# Altium project 2.4GHZ SX1280 4W.PrjPcb
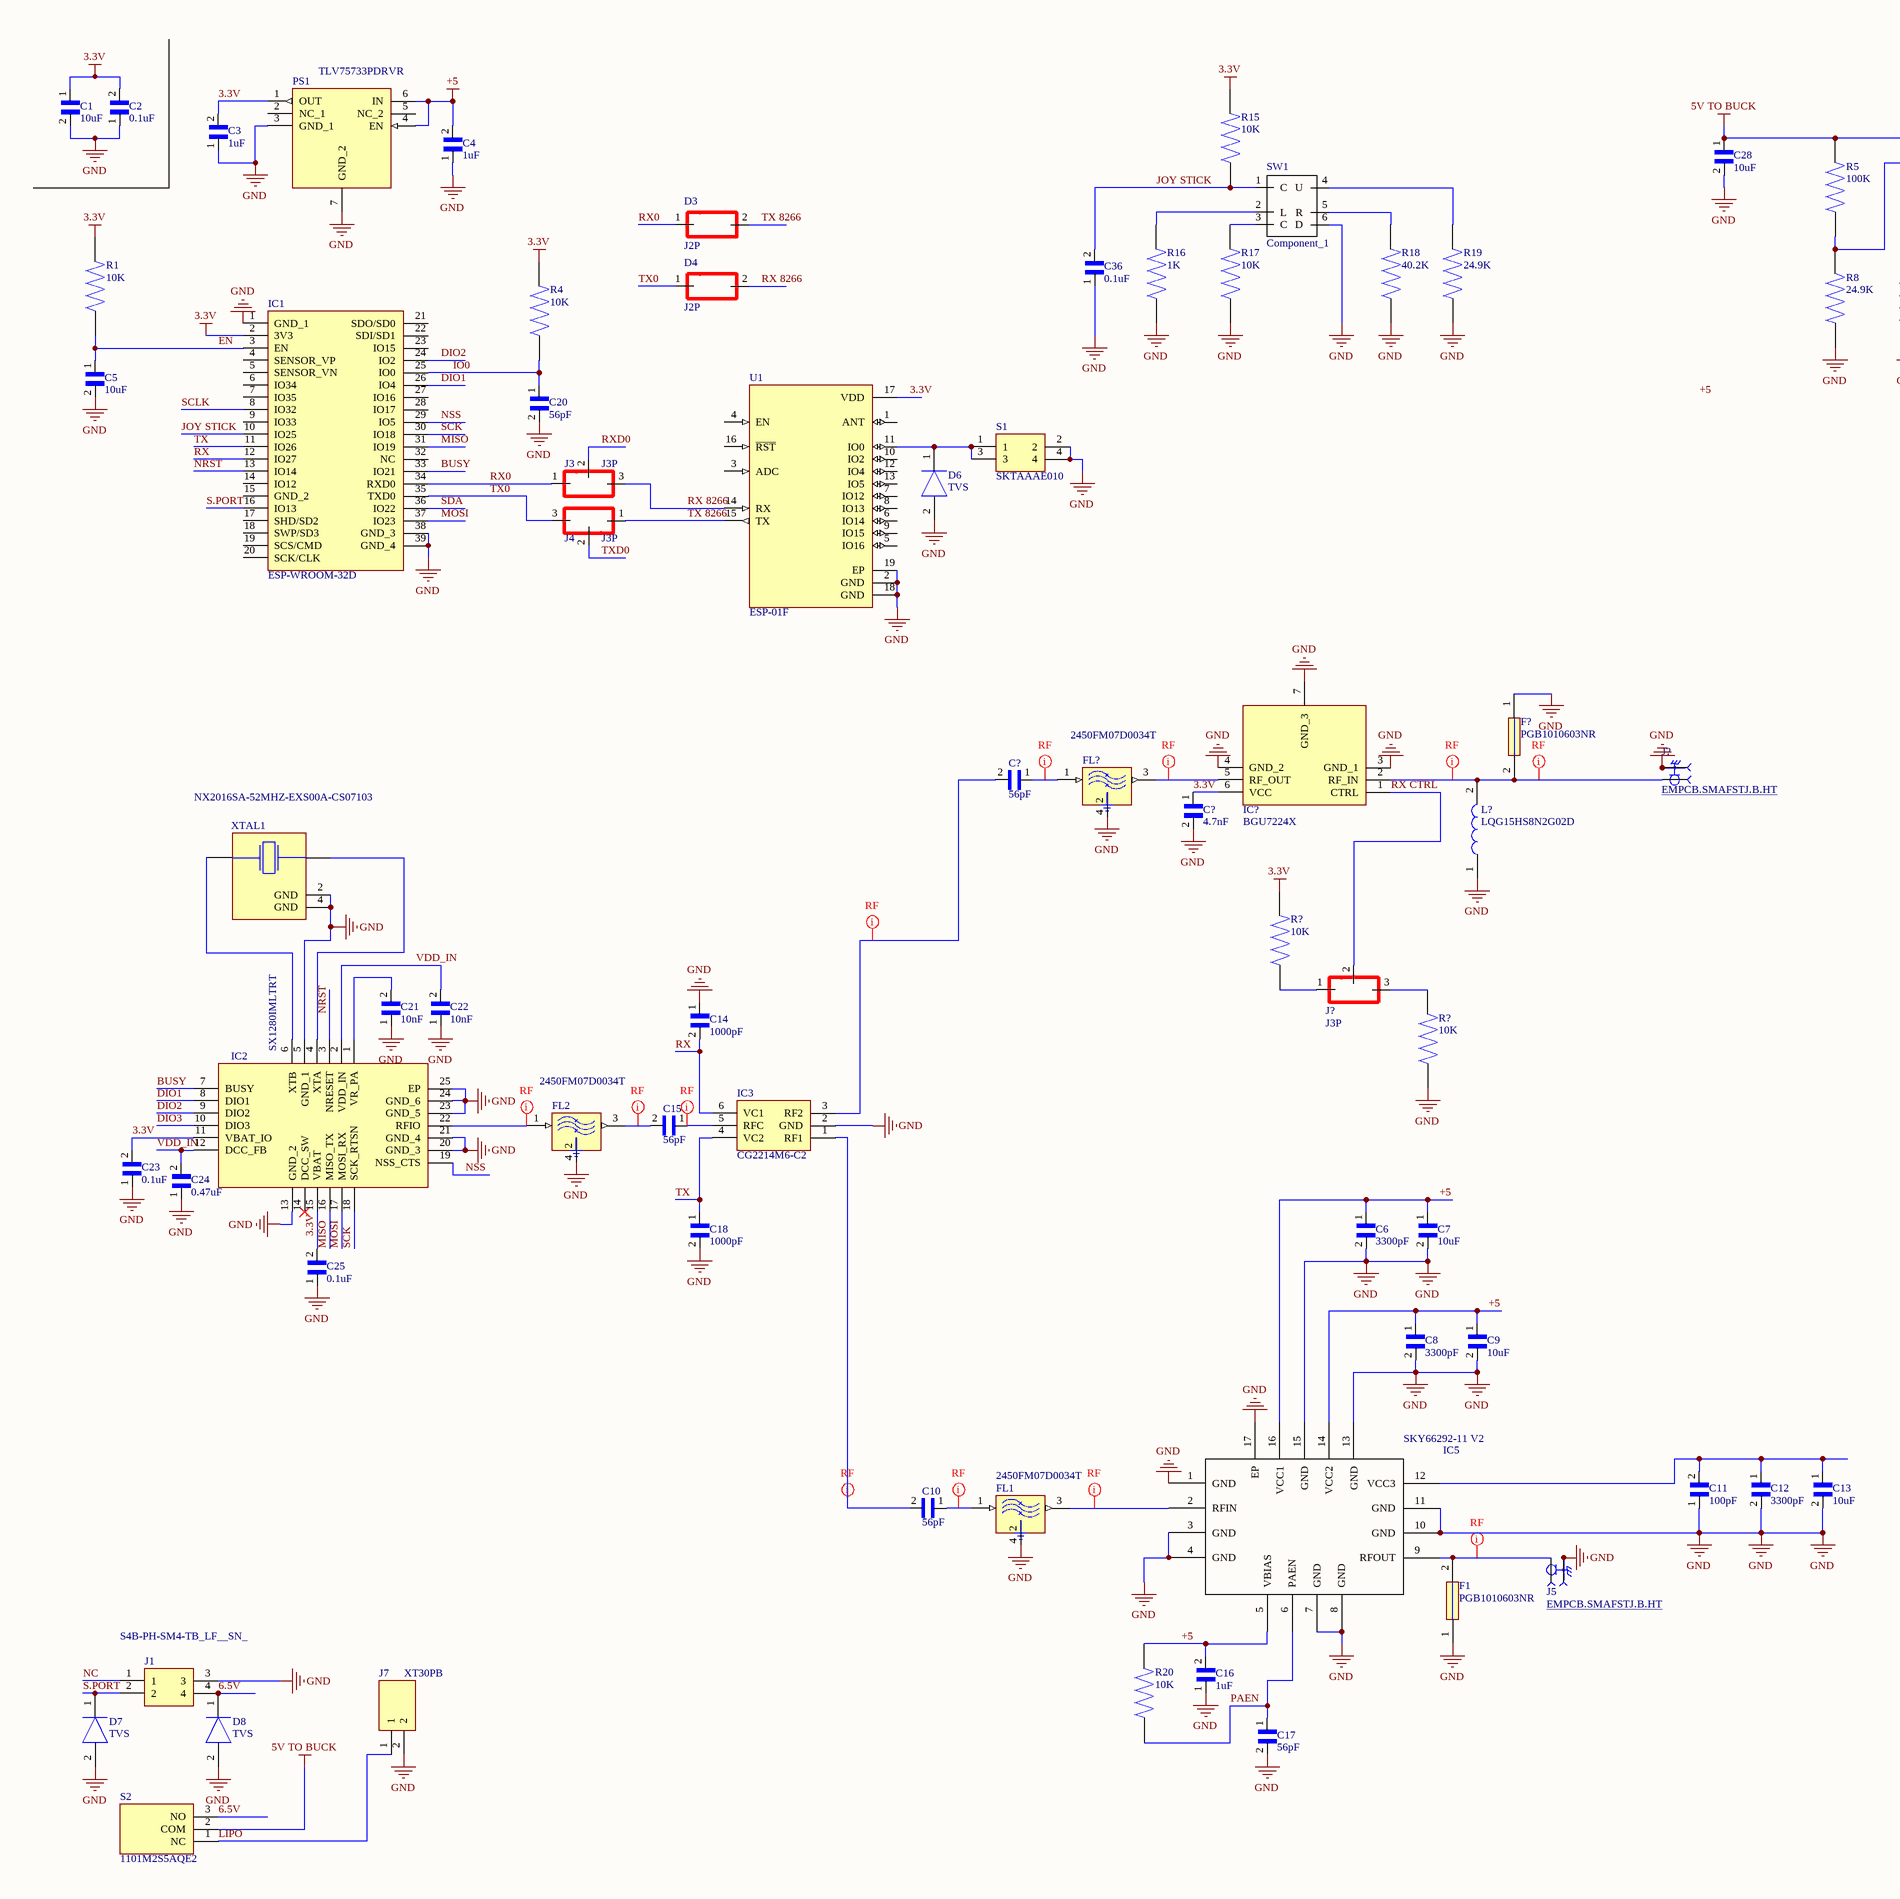
[diagram p0: OD JRBAY.SchDoc, left]
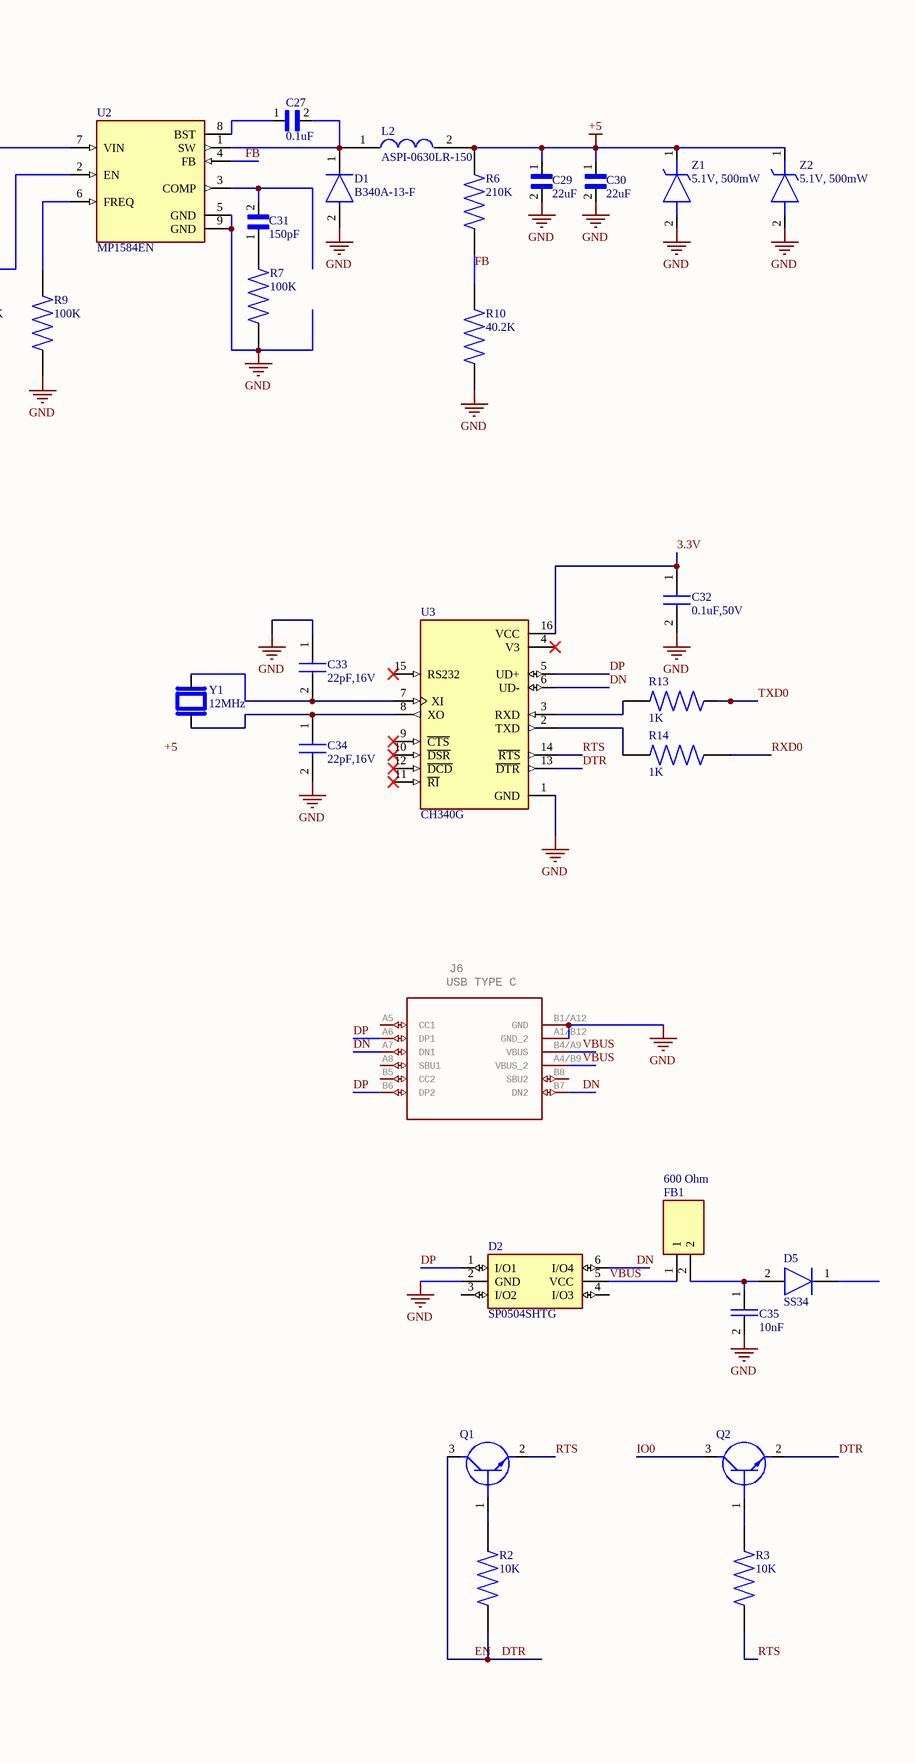
[diagram p1: OD JRBAY.SchDoc, right]
2 sheets, 196 parts. Net scope: global (net labels, ports and power ports of the same name join across sheets).
Board file: OD JRBAY.PcbDoc
Sheets:
  OD JRBAY.SchDoc
  Reference sche.SchDoc

## Sheet OD JRBAY.SchDoc
size A2

### Parts
(Parts that share a designator on the sheet are numbered #1, #2 ... from top to bottom, then left to right.)
C1  10uF  [CAPC2012X140N]
C2  0.1uF  [CAPC1005X56N]
C3  1uF  [CAPC1608X100N]
C4  1uF  [CAPC1608X100N]
C5  10uF  [CAPC2012X140N]
C6  3300pF  [CAPC1005X56N]
C7  10uF  [CAPC2012X140N]
C8  3300pF  [CAPC1005X56N]
C9  10uF  [CAPC2012X140N]
C10  56pF  [CAPC1005X56N]
C11  100pF  [CAPC1608X100N]
C12  3300pF  [CAPC1005X56N]
C13  10uF  [CAPC2012X140N]
C14  1000pF  [CAPC1005X56N]
C15  56pF  [CAPC1005X56N]
C16  1uF  [CAPC1608X100N]
C17  56pF  [CAPC1005X56N]
C18  1000pF  [CAPC1005X56N]
C20  56pF  [CAPC1005X56N]
C21  10nF  [CAPC1608X100N]
C22  10nF  [CAPC1608X100N]
C23  0.1uF  [CAPC1005X56N]
C24  0.47uF  [CAPC1005X56N]
C25  0.1uF  [CAPC1005X56N]
C27  0.1uF  [CAPC1005X56N]
C28  10uF  [CAPC2012X140N]
C29  22uF  [CAPC2012X140N]
C30  22uF  [CAPC2012X140N]
C31  150pF  [CAPC1005X56N]
C32  0.1uF,50V  [CAPC1608X08M]
C33  22pF,16V  [CAPC1608X08M]
C34  22pF,16V  [CAPC1608X08M]
C35  10nF  [CAPC1608X08M]
C36  0.1uF  [CAPC1005X56N]
C?#1  56pF  [CAPC1005X56N]
C?#2  4.7nF  [CAPC1005X56N]
D1  B340A-13-F  [DIOM5226X240N]
D2  SP0504SHTG  [SOT95P280X145-6N]
D3  J2P  [J2P]
D4  J2P  [J2P]
D5  SS34  [DIOM5226X240N]
D6  TVS  [SODFL1608X70N]
D7  TVS  [SODFL1608X70N]
D8  TVS  [SODFL1608X70N]
F1  PGB1010603NR  [FUSC1708X36N]
F?#1  PGB1010603NR  [FUSC1708X36N]
FB1  600 Ohm  [BEADC2012X105N]
FL1  2450FM07D0034T  [FIL_2450FM07D0034T]
FL2  2450FM07D0034T  [FIL_2450FM07D0034T]
FL?#1  2450FM07D0034T  [FIL_2450FM07D0034T]
IC1  ESP-WROOM-32D  [ESPWROOM32D]
IC2  SX1280IMLTRT  [QFN50P400X400X100-25N-D]
IC3  CG2214M6-C2  [SOTFL48P130X55-6N]
IC5  SKY66292-11 V2  [SKY66292-11]
IC?#1  BGU7224X  [SON50P160X160X50-7N]
J1  S4B-PH-SM4-TB_LF__SN_  [S4B-PH-SM4-TB]
J3  J3P  [J3P]
J4  J3P  [J3P]
J5  EMPCB.SMAFSTJ.B.HT  [TAOGLAS_EMPCB.SMAFSTJ.B.HT]
J6  USB TYPE C  [2171790001_MOL]
J7  XT30PB  [XT30PB]
J?#1  EMPCB.SMAFSTJ.B.HT  [TAOGLAS_EMPCB.SMAFSTJ.B.HT]
J?#2  J3P  [J3P]
L2  ASPI-0630LR-150  [ASPI-0630LR-150]
L?#1  LQG15HS8N2G02D  [LQG15WH0N7B02D]
PS1  TLV75733PDRVR  [SON65P200X200X80-7N]
Q1  BC847AMTF  [SOT95P240X120-3N]  (value not drawn)
Q2  BC847AMTF  [SOT95P240X120-3N]  (value not drawn)
R1  10K  [RESC1005X37N]
R2  10K  [RESC1005X37N]
R3  10K  [RESC1005X37N]
R4  10K  [RESC1005X37N]
R5  100K  [RESC1005X37N]
R6  210K  [RESC1005X37N]
R7  100K  [RESC1005X37N]
R8  24.9K  [RESC1005X37N]
R9  100K  [RESC1005X37N]
R10  40.2K  [RESC1005X37N]
R13  1K  [RESC1005X37N]
R14  1K  [RESC1005X37N]
R15  10K  [RESC1005X37N]
R16  1K  [RESC1005X37N]
R17  10K  [RESC1005X37N]
R18  40.2K  [RESC1005X37N]
R19  24.9K  [RESC1005X37N]
R20  10K  [RESC1005X37N]
R?#1  10K  [RESC1005X37N]
R?#2  10K  [RESC1005X37N]
S1  SKTAAAE010  [SKTAAAE010]
S2  1101M2S5AQE2  [1101M2S5AQE2]
SW1  Component_1  [5 WAY SWITCH]
U1  ESP-01F  [MODULE_ESP-01F]
U2  MP1584EN  [SOIC127P600X170-9N]
U3  CH340G  [SOIC127P600X175-16N]
XTAL1  NX2016SA-52MHZ-EXS00A-CS07103  [OSCCC200X160X50N]
Y1  12MHz  [XTAL_SXT2248EE17-12.000MT]
Z1  5.1V, 500mW  [SOD3716X135N]
Z2  5.1V, 500mW  [SOD3716X135N]

### Nets
3.3V: C1.1 C2.2 C3.2 C23.2 C25.2 C32.1 C?#2.1 IC1.2(3V3) IC2.11(VBAT_IO) IC2.15(VBAT) IC?#1.6(VCC) PS1.1(OUT) R1.2 R4.2 R15.2 R?#1.2 U1.17(VDD) U3.16(VCC)
5V TO BUCK: C28.1 R5.2 S2.2(COM) U2.7(VIN)
+5: C4.2 C6.1 C7.1 C8.1 C9.1 C16.2 C29.1 C30.1 IC5.5(VBIAS) IC5.14(VCC2) IC5.16(VCC1) L2.2 PS1.4(EN) PS1.6(IN) R6.2 R20.2 Z1.1(K) Z2.1(K)
GND: C1.2 C2.1 C3.1 C4.1 C5.2 C6.2 C7.2 C8.2 C9.2 C11.1 C12.2 C13.2 C14.1 C16.1 C17.2 C18.2 C20.2 C21.1 C22.1 C23.1 C24.1 C25.1 C28.2 C29.2 C30.2 C32.2 C33.1 C34.2 C35.2 C36.1 C?#2.2 D1.2(A) D2.2(GND) D6.2(A) D7.2(A) D8.2(A) F1.1 F?#1.1 FL1.4(GND) FL2.4(GND) FL?#1.4(GND) IC1.1(GND_1) IC1.38(GND_3) IC1.39(GND_4) IC2.5(GND_1) IC2.13(GND_2) IC2.20(GND_3) IC2.21(GND_4) IC2.23(GND_5) IC2.24(GND_6) IC2.25(EP) IC3.2(GND) IC5.1(GND) IC5.3(GND) IC5.4(GND) IC5.7(GND) IC5.8(GND) IC5.10(GND) IC5.11(GND) IC5.13(GND) IC5.15(GND) IC5.17(EP) IC?#1.3(GND_1) IC?#1.4(GND_2) IC?#1.7(GND_3) J1.3 J5.SH1 J5.SH2 J5.SH3 J5.SH4 J6.A1/B12(GND_2) J6.B1/A12(GND) J7.2 J?#1.SH1 J?#1.SH2 J?#1.SH3 J?#1.SH4 L?#1.1 PS1.3(GND_1) PS1.7(GND_2) R7.1 R8.1 R9.1 R10.1 R16.1 R17.1 R18.1 R19.1 R?#2.1 S1.2 S1.4 SW1.6(D) U1.2(GND) U1.18(GND) U1.19(EP) U2.5(GND) U2.9(GND) U3.1(GND) XTAL1.2(GND) XTAL1.4(GND) Z1.2(A) Z2.2(A)
6.5V: D8.1(K) J1.4 S2.3(NO)
BUSY: IC1.33(IO21) IC2.7(BUSY)
DIO1: IC1.26(IO4) IC2.8(DIO1)
DIO2: IC1.24(IO2) IC2.9(DIO2)
DIO3: IC2.10(DIO3)
DN: D2.6(I/O4) J6.A7(DN1) J6.B7(DN2) U3.6(UD-)
DP: D2.1(I/O1) J6.A6(DP1) J6.B6(DP2) U3.5(UD+)
DTR: C5.1 IC1.3(EN) Q1.3(C) Q2.2(E) R1.1 R2.1 U3.13(~{DTR})  [also labelled EN]
FB: R6.1 R10.2 U2.4(FB)
IO0: C20.1 IC1.25(IO0) Q2.3(C) R4.1
JOY STICK: C36.2 IC1.10(IO25) R15.1 SW1.1(C)
LIPO: J7.1 S2.1(NC)
MISO: IC1.31(IO19) IC2.16(MISO_TX)
MOSI: IC1.37(IO23) IC2.17(MOSI_RX)
NC: J1.1
NRST: IC1.13(IO14) IC2.3(NRESET)
NSS: IC1.29(IO5) IC2.19(NSS_CTS)
PAEN: C17.1 IC5.6(PAEN) R20.1
RTS: Q1.2(E) R3.1 U3.14(~{RTS})
RX: C14.2 IC1.12(IO27) IC3.6(VC1)
RX0: D3.1 IC1.34(RXD0) J3.1
RX 8266: D4.2 J3.3 U1.14(RX)
RX CTRL: IC?#1.1(CTRL) J?#2.2
RXD0: J3.2 R14.1
S.PORT: D7.1(K) IC1.16(IO13) J1.2
SCK: IC1.30(IO18) IC2.18(SCK_RTSN)
SCLK: IC1.8(IO32)
SDA: IC1.36(IO22)
TX: C18.1 IC1.11(IO26) IC3.4(VC2)
TX0: D4.1 IC1.35(TXD0) J4.3
TX 8266: D3.2 J4.1 U1.15(TX)
TXD0: J4.2 R13.1
VBUS: D2.5(VCC) FB1.1 J6.A4/B9(VBUS_2) J6.B4/A9(VBUS)
VDD_IN: C22.2 C24.2 IC2.2(VDD_IN) IC2.12(DCC_FB)
NetC10_1: C10.1 FL1.1(IN)
NetC10_2: C10.2 IC3.1(RF1)
NetC11_2: C11.2 C12.1 C13.1 IC5.12(VCC3)
NetC15_1: C15.1 IC3.5(RFC)
NetC15_2: C15.2 FL2.3(OUT)
NetC21_2: C21.2 IC2.1(VR_PA)
NetC27_1: C27.1 U2.8(BST)
NetC27_2: C27.2 D1.1(K) L2.1 U2.1(SW)
NetC31_1: C31.1 R7.2
NetC31_2: C31.2 U2.3(COMP)
NetC33_2: C33.2 U3.7(XI) Y1.3
NetC34_1: C34.1 U3.8(XO) Y1.1
NetC35_1: C35.1 D5.2(A) FB1.2
NetC?#1_1: C?#1.1 FL?#1.1(IN)
NetC?#1_2: C?#1.2 IC3.3(RF2)
NetD6_1: D6.1(K) S1.1 S1.3 U1.11(IO0)
NetF1_2: F1.2 IC5.9(RFOUT) J5.1
NetF?#1_2: F?#1.2 IC?#1.2(RF_IN) J?#1.1 L?#1.2
NetFL1_3: FL1.3(OUT) IC5.2(RFIN)
NetFL2_1: FL2.1(IN) IC2.22(RFIO)
NetFL?#1_3: FL?#1.3(OUT) IC?#1.5(RF_OUT)
NetIC2_4: IC2.4(XTA) XTAL1.3(B)
NetIC2_6: IC2.6(XTB) XTAL1.1(A)
NetJ?#2_1: J?#2.1 R?#1.1
NetJ?#2_3: J?#2.3 R?#2.2
NetQ1_1: Q1.1(B) R2.2
NetQ2_1: Q2.1(B) R3.2
NetR5_1: R5.1 R8.2 U2.2(EN)
NetR9_2: R9.2 U2.6(FREQ)
NetR13_2: R13.2 U3.3(RXD)
NetR14_2: R14.2 U3.2(TXD)
NetR16_2: R16.2 SW1.2(L)
NetR17_2: R17.2 SW1.3(C)
NetR18_2: R18.2 SW1.5(R)
NetR19_2: R19.2 SW1.4(U)

Not connected (* = marked no-connect by the designer): D2 3(I/O2) 4(I/O3); D5 1(K); FL1 2(GND); FL2 2(GND); FL?#1 2(GND); IC1 4(SENSOR_VP) 5(SENSOR_VN) 6(IO34) 7(IO35) 9(IO33) 14(IO12) 15(GND_2) 17(SHD/SD2) 18(SWP/SD3) 19(SCS/CMD) 20(SCK/CLK) 21(SDO/SD0) 22(SDI/SD1) 23(IO15) 27(IO16) 28(IO17) 32(NC); IC2 14(DCC_SW)*; J6 A5(CC1) A8(SBU1) B5(CC2) B8(SBU2); PS1 2(NC_1) 5(NC_2); U1 1(ANT) 3(ADC) 4(EN) 5(IO16) 6(IO14) 7(IO12) 8(IO13) 9(IO15) 10(IO2) 12(IO4) 13(IO5) 16(~{RST}); U3 4(V3)* 9(~{CTS})* 10(~{DSR})* 11(~{RI})* 12(~{DCD})* 15(RS232)*

### Layout directives
net class RF: NetC10_1, NetC10_2, NetC15_1, NetC15_2, NetC?#1_1, NetC?#1_2, NetF1_2, NetF?#1_2, NetFL1_3, NetFL2_1, NetFL?#1_3

### Notes on the sheet
- Labels drawn without touching a wire or pin: +5

### Library data of the parts
C1 C5 C7 C9 C13 C28-C30 = CL21B104KBCNNNC: Cap Ceramic 0.1uF 50VDC X7R 10% SMD 0805 Paper T/R; MF: {'manufacturer': u'Samsung'}; Availability: Unavailable; Package: None; MP: CL21B104KBCNNNC; Value: *; Price: None
C2 C6 C8 C10 C12 C14 C15 C17 C18 C20 C23-C25 C27 C31 C36 C?#1 C?#2 = 04025C104KAT2A: CAP, MLCC, X7R, 0.1UF, 50V, 0402; MF: {'manufacturer': u'AVX'}; Availability: Unavailable; Package: None; MP: 04025C104KAT2A; Value: *; Price: None
C3 C4 C11 C16 C21 C22 = CL10F104ZB8NNNC: Capacitor 0603 0.1uF Y5V; MF: {'manufacturer': u'Samsung'}; Availability: Unavailable; Package: None; MP: CL10F104ZB8NNNC; Value: *; Price: None
C32 = CL10B104KB8NNNL: Capacitor; Manufacturer: Samsung Electro-Mechanics; Component Name: 0.1 µF ±10% 50V Ceramic Capacitor X7R 0603 (1608 Metric); Unit Price/(500pcs): ₹ 0.72; MFR Part no: CL10B104KB8NNNL; Package: 0603 [1608 Metric]
C33 C34 = CL10B105KP8NNNC: Capacitor; MFR Part no: 0603YA220KAT2A; Manufacturer: KYOCERA AVX; Unit Price/(500pcs): ₹ 0.77; Component Name: 22PF ,16V; Package: 0603 (1608 Metric)
C35 = C0603: Component Name: *; MFR Part no: *; Manufacturer: *; Unit Price/(500pcs): *; Package: *
D1 = B340A-13-F: Diode; Manufacturer_Name: Diodes Inc.; Datasheet Link: https://datasheet.datasheetarchive.com/originals/distributors/Datasheets-305/73551.pdf; Height: 2.4mm; Manufacturer_Part_Number: B340A-13-F; Mouser Part Number: 621-B340A-F; Mouser Price/Stock: https://www.mouser.co.uk/ProductDetail/Diodes-Incorporated/B340A-13-F?qs=aLaTXeBcTP9fj%2FYKVo6Q1A%3D%3D; Arrow Part Number: B340A-13-F; Arrow Price/Stock: https://www.arrow.com/en/products/b340a-13-f/diodes-incorporated?region=nac
D2 = SP0504SHTG: Diode; Manufacturer_Name: LITTELFUSE; Manufacturer: LITTLE FUSE; Component Name: ESD TVS DIODE; Unit Price/(500pcs): ₹ 23.57; Datasheet Link: http://www.littelfuse.com/~/media/electronics/datasheets/tvs_diode_arrays/littelfuse_tvs_diode_array_sp0504s_datasheet.pdf.pdf; Height: 1.45mm; Manufacturer_Part_Number: SP0504SHTG; Mouser Part Number: 576-SP0504SHTG; Mouser Price/Stock: https://www.mouser.co.uk/ProductDetail/Littelfuse/SP0504SHTG?qs=VPR2Pdj9HgCFO7boWWEmwA%3D%3D; Arrow Part Number: SP0504SHTG; Arrow Price/Stock: https://www.arrow.com/en/products/sp0504shtg/littelfuse?region=nac; MFR Part no: SP0504SHTG; Package: SOT23
D5 = B340A-13-F: Diode; Manufacturer: SUNROM; Component Name: SCHOTTKY DIODE; Unit Price/(500pcs): 4.25; Package: DO-214AC; MFR Part no: SUNROM 4447
D6-D8 = ESD5Z3.3T1G: Diode; Manufacturer_Name: ON Semiconductor; Manufacturer: ONSEMI; Component Name: TVS Diode, ESD5Z Series, Unidirectional, 3.3 V; Unit Price/(500pcs): ₹ 5.98; Datasheet Link: http://www.onsemi.com/pub/Collateral/ESD5Z2.5T1-D.PDF; Height: 0.7mm; Manufacturer_Part_Number: ESD5Z3.3T1G; Mouser Part Number: 863-ESD5Z3.3T1G; Mouser Price/Stock: https://www.mouser.co.uk/ProductDetail/onsemi/ESD5Z33T1G?qs=OSf9jACorvaH3Y8oRWEcuQ%3D%3D; Arrow Part Number: ESD5Z3.3T1G; Arrow Price/Stock: https://www.arrow.com/en/products/esd5z3.3t1g/on-semiconductor?region=nac; MFR Part no: ESD5Z3.3T1G; Package: SOD-523-2
F1 F?#1 = PGB1010603NR: Fuse; Manufacturer_Name: LITTELFUSE; Manufacturer: Littelfuse Inc.; Component Name: TVS DIODE 24VWM 150VC 0603; Unit Price/(500pcs): ₹ 26.71; Datasheet Link: https://componentsearchengine.com/Datasheets/2/PGB1010603NR.pdf; Height: 0.36mm; Manufacturer_Part_Number: PGB1010603NR; Mouser Part Number: 576-PGB1010603NR; Mouser Price/Stock: https://www.mouser.co.uk/ProductDetail/Littelfuse/PGB1010603NR?qs=gu7KAQ731UTJOoBJUwB8FA%3D%3D; Arrow Part Number: PGB1010603NR; Arrow Price/Stock: https://www.arrow.com/en/products/pgb1010603nr/littelfuse?region=nac; MFR Part no: PGB1010603NR; Package: 0603 [1608 Metric]
FB1 = MPZ2012S221A: Ferrite Bead; MFR Part no: MMZ2012Y601BT000; Manufacturer: TDK; Unit Price/(500pcs): ₹ 2.48; Component Name: 600 OHM; Package: 0805 (2012 Metric)
FL1 FL2 FL?#1 = 2450FM07D0034T: 2.4GHz ~ 2.5GHz Frequency RF Filter (Radio Frequency) 100MHz Bandwidth 0.75dB 0402 (1005 Metric), 4 PC Pad; MF: {'manufacturer': u'Johanson Technology Inc.'}; Value: *; Availability: Unavailable; Price: None; Package: None; MP: 2450FM07D0034T
IC1 = ESP-WROOM-32D: Integrated Circuit; Manufacturer_Name: Espressif Systems; Datasheet Link: https://componentsearchengine.com/Datasheets/1/ESP-WROOM-32D.pdf; Height: 3.2mm; Manufacturer_Part_Number: ESP-WROOM-32D; Mouser Part Number: 356-ESP-WROOM-32D; Mouser Price/Stock: https://www.mouser.co.uk/ProductDetail/Espressif-Systems/ESP-WROOM-32D?qs=MLItCLRbWsyWVKgdQMcFuQ%3D%3D
IC2 = SX1280IMLTRT: Integrated Circuit; Manufacturer_Name: SEMTECH; Datasheet Link: https://datasheet.datasheetarchive.com/originals/distributors/DKDS-37/728740.pdf; Height: 1mm; Manufacturer_Part_Number: SX1280IMLTRT; Mouser Part Number: 947-SX1280IMLTRT; Mouser Price/Stock: https://www.mouser.co.uk/ProductDetail/Semtech/SX1280IMLTRT?qs=5aG0NVq1C4xuoq8G6ZzdxQ%3D%3D; Arrow Part Number: SX1280IMLTRT; Arrow Price/Stock: https://www.arrow.com/en/products/sx1280imltrt/semtech
IC3 = CG2214M6-C2: Integrated Circuit; Manufacturer_Name: CEL; Datasheet Link: http://www.cel.com/pdf/datasheets/CG2214M6.pdf; Height: 0.55mm; Manufacturer_Part_Number: CG2214M6-C2; Mouser Part Number: 551-CG2214M6-C2; Mouser Price/Stock: https://www.mouser.co.uk/ProductDetail/CEL/CG2214M6-C2?qs=tucQmhgEO3pgt47Dr78trg%3D%3D; Arrow Part Number: CG2214M6-C2; Arrow Price/Stock: https://www.arrow.com/en/products/cg2214m6-c2/california-eastern-laboratories
IC?#1 = BGU7224X: Integrated Circuit; Manufacturer_Name: NXP; Datasheet Link: http://www.nxp.com/docs/en/data-sheet/BGU7224.pdf; Height: 0.5mm; Manufacturer_Part_Number: BGU7224X; Mouser Part Number: 771-BGU7224X; Mouser Price/Stock: https://www.mouser.co.uk/ProductDetail/NXP-Semiconductors/BGU7224X?qs=Sd2AGZv2AHkyYARpdSjAzA%3D%3D; Arrow Part Number: BGU7224X; Arrow Price/Stock: https://www.arrow.com/en/products/bgu7224x/nxp-semiconductors
J1 = S4B-PH-SM4-TB_LF__SN_: Connector; Manufacturer_Name: JST (JAPAN SOLDERLESS TERMINALS); Manufacturer_Part_Number: S4B-PH-SM4-TB(LF)(SN); Datasheet Link: http://uk.rs-online.com/web/p/products/6881366; Arrow Part Number: S4B-PH-SM4-TB(LF)(SN); Arrow Price/Stock: https://www.arrow.com/en/products/s4b-ph-sm4-tb-lf-sn/jst-manufacturing
J5 J?#1 = EMPCB.SMAFSTJ.B.HT: SMA Connector Jack, Female Socket 50Ohm Board Edge, End Launch Solder; MF: Taoglas Limited; Value: *; Package: None; Digi-Key_Part_Number: 931-1175-ND; Digi-Key_Purchase_URL: https://www.digikey.com/product-detail/en/taoglas-limited/EMPCB.SMAFSTJ.B.HT/931-1175-ND/3522337?utm_source=snapeda&utm_medium=aggregator&utm_campaign=symbol; MP: EMPCB.SMAFSTJ.B.HT; SnapEDA_Link: https://www.snapeda.com/parts/EMPCB.SMAFSTJ.B.HT/Taoglas%20Limited/view-part/231078/?ref=snap
J6 = 2171790001: MFR_NAME: Molex Connector Corporation; MFR Part no: 5365; Manufacturer: SUNROM; GateName_1: A; Unit Price/(500pcs): ₹ 36.34; SymbolName_1: 2171790001; LibraryName: TYPE C; DeviceSetName: 2171790001; COPYRIGHT: Copyright (C) 2021 Ultra Librarian. All rights reserved.; DIGI-KEY_PART_NUMBER_1: 900-2171790001TR-ND; DIGI-KEY_PART_NUMBER_2: 900-2171790001CT-ND; DIGI-KEY_PART_NUMBER_3: 900-2171790001DKR-ND; MANUFACTURER_PART_NUMBER: 2171790001; Component Name: USB TYPE C; Package: THROUGH HOLE
J7 = XT30PB: Connector; Manufacturer_Name: Amass; Datasheet Link: https://www.tme.eu/Document/4acc913878197f8c2e30d4b8cdc47230/XT30UPB%20SPEC.pdf; Height: 10.7mm; Manufacturer_Part_Number: XT30PB
L?#1 = LQG15HS8N2G02D: Inductor; Manufacturer_Name: Murata Electronics; Datasheet Link: https://psearch.en.murata.com/inductor/product/LQG15HS8N2G02%23.html; Height: 0.55mm; Manufacturer_Part_Number: LQG15HS8N2G02D; Mouser Part Number: 81-LQG15HS8N2G02D; Mouser Price/Stock: https://www.mouser.co.uk/ProductDetail/Murata-Electronics/LQG15HS8N2G02D?qs=d0WKAl%252BL4KapDveqKJ4FDA%3D%3D
PS1 = TLV75733PDRVR: Power Supply; Manufacturer_Name: Texas Instruments; Datasheet Link: http://www.ti.com/lit/gpn/tlv757p; Height: 0.8mm; Manufacturer_Part_Number: TLV75733PDRVR; Mouser Part Number: 595-TLV75733PDRVR; Mouser Price/Stock: https://www.mouser.co.uk/ProductDetail/Texas-Instruments/TLV75733PDRVR?qs=W0yvOO0ixfGlytsi33vetg%3D%3D; Arrow Part Number: TLV75733PDRVR; Arrow Price/Stock: https://www.arrow.com/en/products/tlv75733pdrvr/texas-instruments?region=nac
Q1 Q2 = BC847AMTF: Transistor BJT NPN; Manufacturer_Name: ON Semiconductor; MFR Part no: BC847; Manufacturer: ONSEMI; Unit Price/(500pcs): ₹ 4.83; Datasheet Link: http://www.onsemi.com/pub/Collateral/BC846-D.PDF; Height: 1.2mm; Manufacturer_Part_Number: BC847AMTF; Mouser Part Number: 512-BC847AMTF; Mouser Price/Stock: https://www.mouser.com/Search/Refine.aspx?Keyword=512-BC847AMTF; Arrow Part Number: BC847AMTF; Arrow Price/Stock: https://www.arrow.com/en/products/bc847amtf/on-semiconductor; Component Name: TRANSISTOR; Package: SOT23
R1-R10 R13-R20 R?#1 R?#2 = RE0402BRE07330KL: MF: {'manufacturer': u'Yageo'}; Availability: Unavailable; Package: None; MP: RE0402BRE07330KL; Value: *; Price: None
S1 = SKTAAAE010: Switch; Manufacturer_Name: ALPS; Datasheet Link: https://componentsearchengine.com/Datasheets/1/SKTAAAE010.pdf; Height: 0.63mm; Manufacturer_Part_Number: SKTAAAE010; Mouser Part Number: 688-SKTAAAE010; Mouser Price/Stock: https://www.mouser.co.uk/ProductDetail/ALPS/SKTAAAE010?qs=u4fy%2FsgLU9NVRRqWeykmWg%3D%3D
S2 = 1101M2S5AQE2: Switch; Manufacturer_Name: C & K COMPONENTS; Manufacturer: SUNROM; Component Name: SPDT SWITCH THROUGH HOLE; Unit Price/(500pcs): 15.23; Datasheet Link: https://www.arrow.com/en/products/1101m2s5aqe2/ck; Height: 6.6mm; Manufacturer_Part_Number: 1101M2S5AQE2; Mouser Part Number: 611-1101M2S5AQE2; Mouser Price/Stock: https://www.mouser.co.uk/ProductDetail/CK/1101M2S5AQE2?qs=lwH5WijZ8egIsHAjqlMdZA%3D%3D; Arrow Part Number: 1101M2S5AQE2; Arrow Price/Stock: https://www.arrow.com/en/products/1101m2s5aqe2/ck?region=nac; MFR Part no: SUNROM 5263; Package: THROUGH HOLE
U1 = ESP-01F: 802.11b/g/n Wi-Fi SOC module; MF: AI-Thinker; SnapEDA_Link: https://www.snapeda.com/parts/ESP-01F/AI-Thinker/view-part/5470732/?ref=snap; Availability: Unavailable; Price: None; Package: Package; Check_prices: https://www.snapeda.com/parts/ESP-01F/AI-Thinker/view-part/5470732/?ref=eda; Value: *; MP: ESP-01F
U2 = MP1584EN: 3A, 1.5MHz, 28V Step-Down Converter; MF: {'manufacturer': u'Monolithic Power'}; Availability: Unavailable; Package: None; MP: MP1584EN; Value: *; Price: None
XTAL1 = NX2016SA-52MHZ-EXS00A-CS07103: CRYSTAL 52MHZ 10PF SMD; MF: {'manufacturer': u'NDK America, Inc.'}; Value: *; Availability: Unavailable; Price: None; Package: None; MP: NX2016SA-52MHZ-EXS00A-CS07103
Y1 = SXT2248EE17-12.000MT: MF: {'manufacturer': u'Suntsu'}; Package: None; Value: *; Availability: Unavailable; MP: SXT2248EE17-12.000MT; Price: None
Z1 Z2 = MMSZ5231BT1G: Zener Diode; Manufacturer_Name: ON Semiconductor; Manufacturer: ONSEMI; Component Name: 5.1V 500mW; Unit Price/(500pcs): ₹ 6.57; Datasheet Link: http://www.onsemi.com/pub_link/Collateral/MMSZ5221BT1-D.PDF; Height: 1.35mm; Manufacturer_Part_Number: MMSZ5231BT1G; Mouser Part Number: 863-MMSZ5231BT1G; Mouser Price/Stock: https://www.mouser.co.uk/ProductDetail/onsemi/MMSZ5231BT1G?qs=P4IOph%252Bbot%2FUEpHENPMrdw%3D%3D; Arrow Part Number: MMSZ5231BT1G; Arrow Price/Stock: https://www.arrow.com/en/products/mmsz5231bt1g/on-semiconductor?region=nac; MFR Part no: MMSZ5231BT1G; Package: SOD123
U3 = CH340G: Package: None

## Sheet Reference sche.SchDoc
size A2
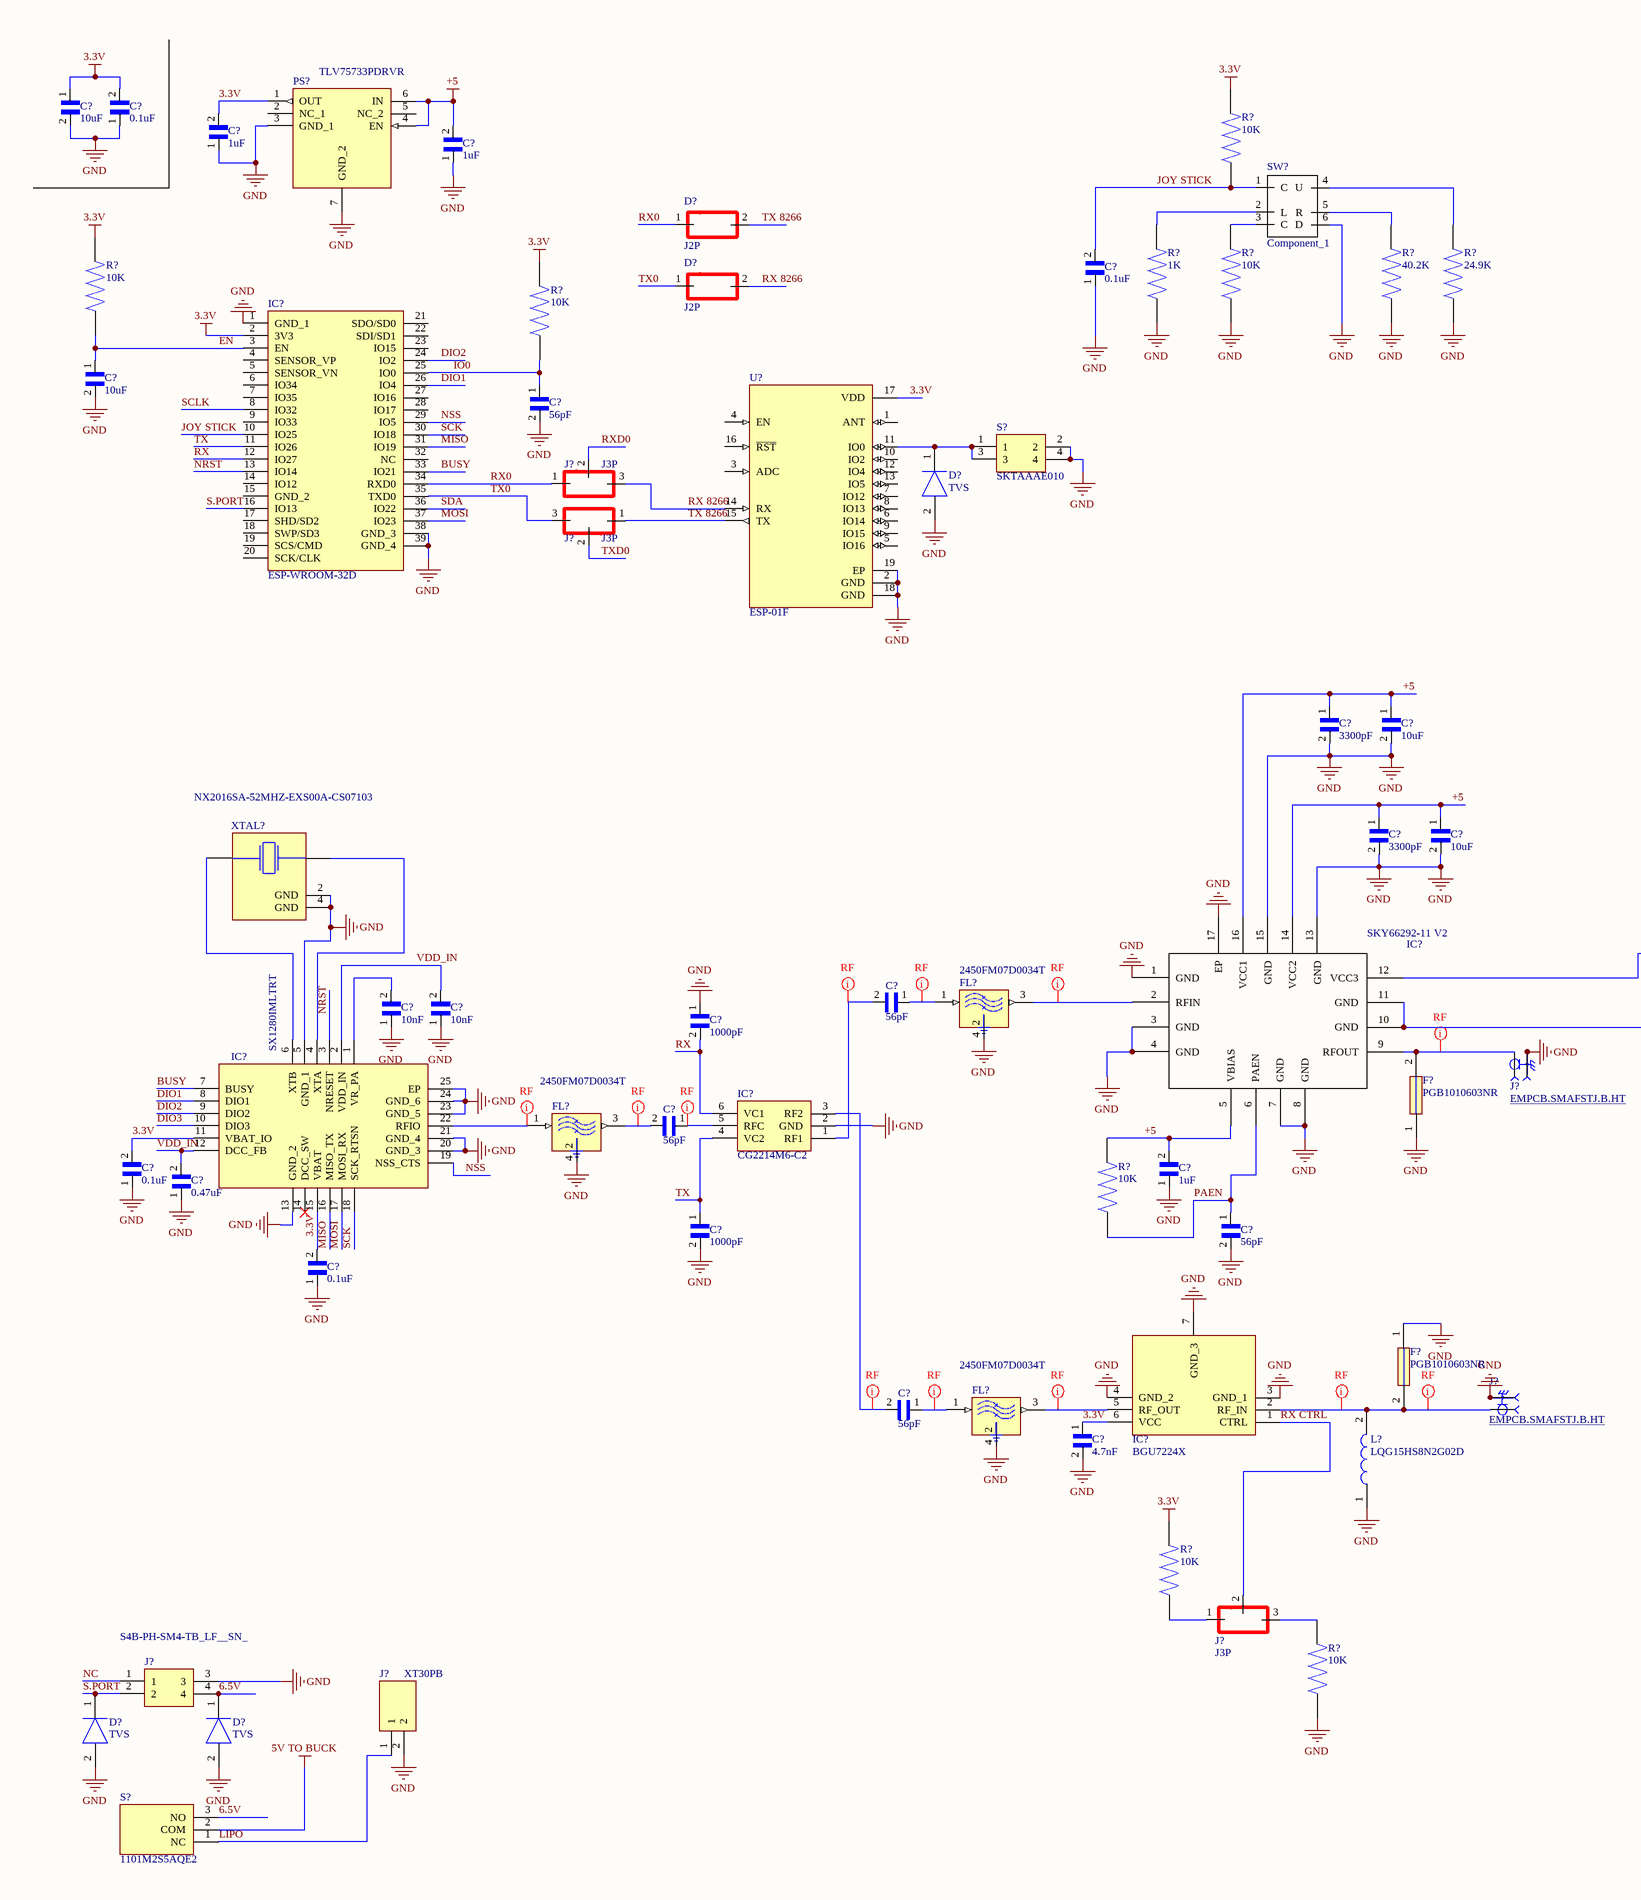
[diagram p2: Reference sche.SchDoc, left]
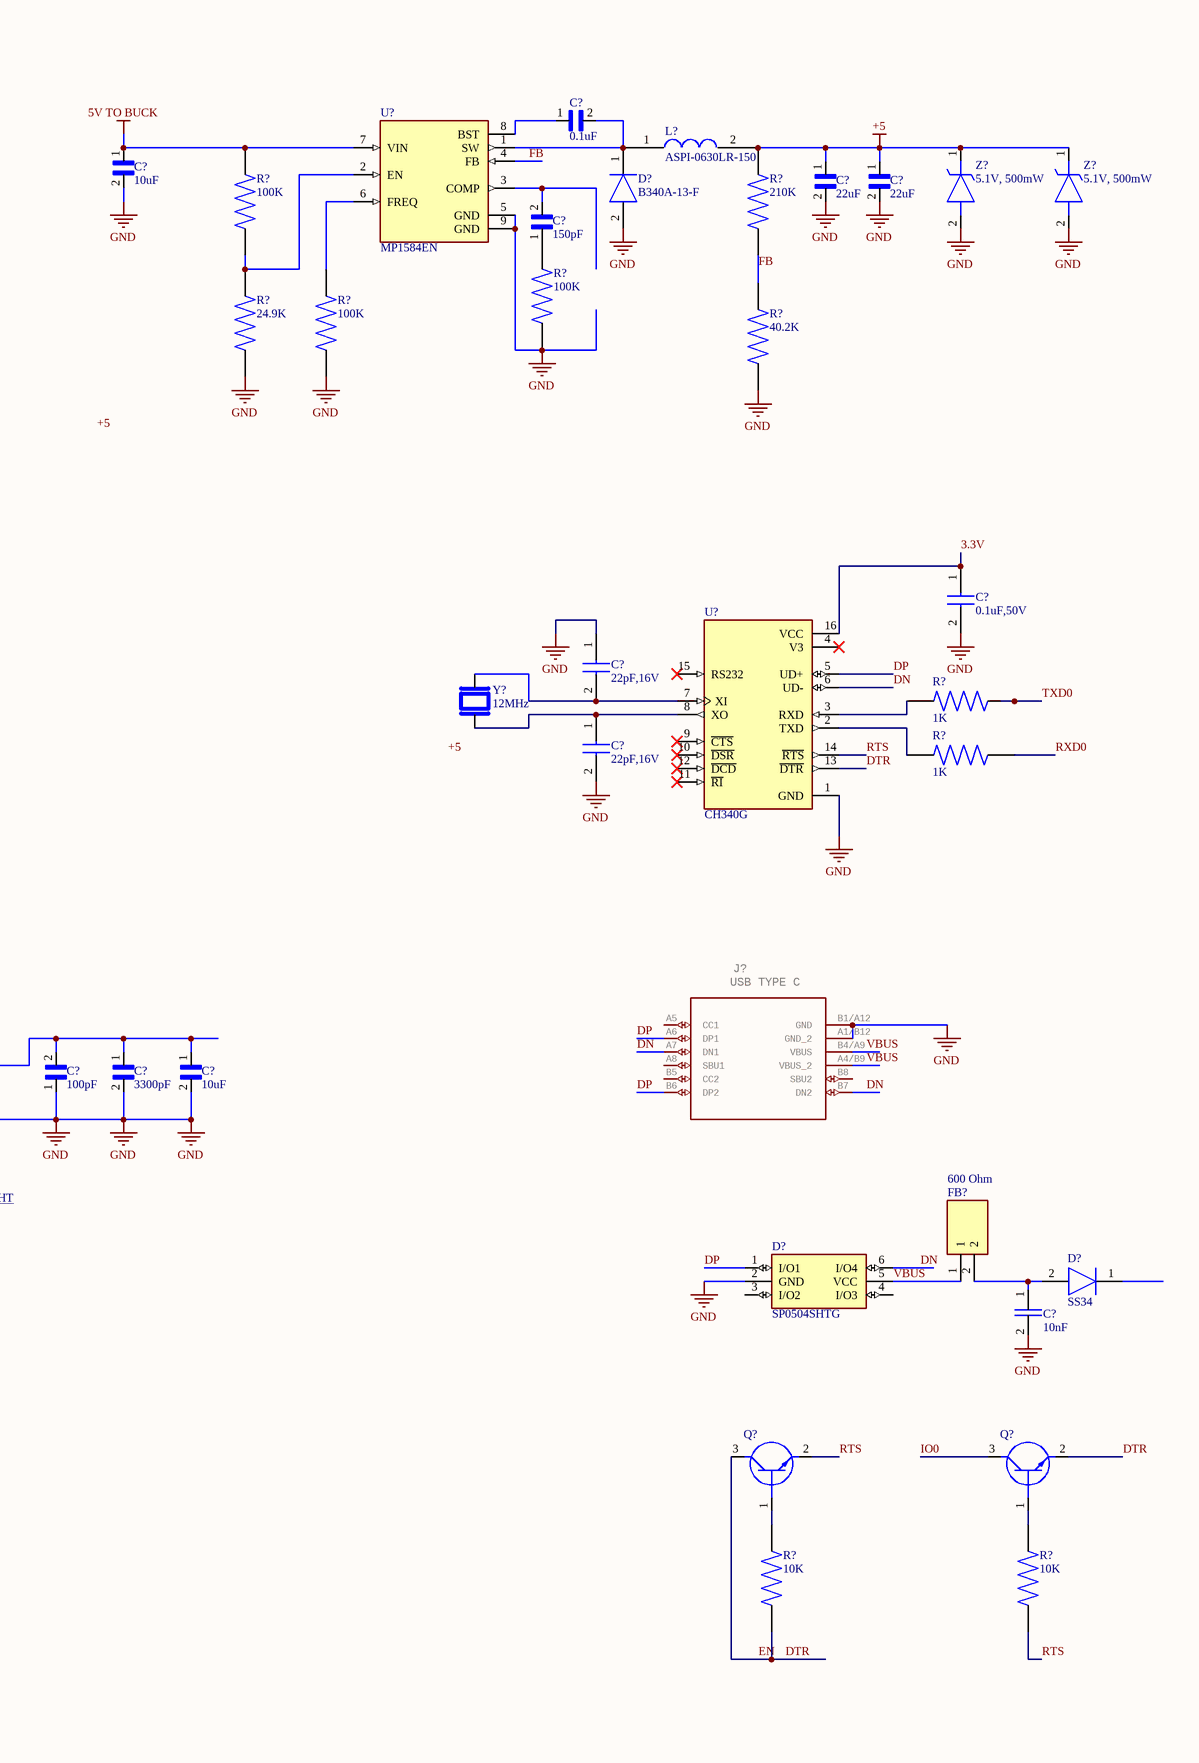
[diagram p3: Reference sche.SchDoc, right]

### Parts
(Parts that share a designator on the sheet are numbered #1, #2 ... from top to bottom, then left to right.)
C?#3  10uF  [CAPC2012X140N]
C?#4  0.1uF  [CAPC1005X56N]
C?#5  0.1uF  [CAPC1005X56N]
C?#6  1uF  [CAPC1608X100N]
C?#7  1uF  [CAPC1608X100N]
C?#8  10uF  [CAPC2012X140N]
C?#9  22uF  [CAPC2012X140N]
C?#10  22uF  [CAPC2012X140N]
C?#11  150pF  [CAPC1005X56N]
C?#12  0.1uF  [CAPC1005X56N]
C?#13  10uF  [CAPC2012X140N]
C?#14  56pF  [CAPC1005X56N]
C?#15  0.1uF,50V  [CAPC1608X08M]
C?#16  22pF,16V  [CAPC1608X08M]
C?#17  22pF,16V  [CAPC1608X08M]
C?#18  3300pF  [CAPC1005X56N]
C?#19  10uF  [CAPC2012X140N]
C?#20  3300pF  [CAPC1005X56N]
C?#21  10uF  [CAPC2012X140N]
C?#22  3300pF  [CAPC1005X56N]
C?#23  100pF  [CAPC1608X100N]
C?#24  10uF  [CAPC2012X140N]
C?#25  56pF  [CAPC1005X56N]
C?#26  10nF  [CAPC1608X100N]
C?#27  10nF  [CAPC1608X100N]
C?#28  1000pF  [CAPC1005X56N]
C?#29  56pF  [CAPC1005X56N]
C?#30  0.1uF  [CAPC1005X56N]
C?#31  1uF  [CAPC1608X100N]
C?#32  0.47uF  [CAPC1005X56N]
C?#33  10nF  [CAPC1608X08M]
C?#34  1000pF  [CAPC1005X56N]
C?#35  56pF  [CAPC1005X56N]
C?#36  0.1uF  [CAPC1005X56N]
C?#37  56pF  [CAPC1005X56N]
C?#38  4.7nF  [CAPC1005X56N]
D?#1  B340A-13-F  [DIOM5226X240N]
D?#2  J2P  [J2P]
D?#3  J2P  [J2P]
D?#4  TVS  [SODFL1608X70N]
D?#5  SP0504SHTG  [SOT95P280X145-6N]
D?#6  SS34  [DIOM5226X240N]
D?#7  TVS  [SODFL1608X70N]
D?#8  TVS  [SODFL1608X70N]
F?#2  PGB1010603NR  [FUSC1708X36N]
F?#3  PGB1010603NR  [FUSC1708X36N]
FB?  600 Ohm  [BEADC2012X105N]
FL?#2  2450FM07D0034T  [FIL_2450FM07D0034T]
FL?#3  2450FM07D0034T  [FIL_2450FM07D0034T]
FL?#4  2450FM07D0034T  [FIL_2450FM07D0034T]
IC?#2  ESP-WROOM-32D  [ESPWROOM32D]
IC?#3  SKY66292-11 V2  [SKY66292-11]
IC?#4  SX1280IMLTRT  [QFN50P400X400X100-25N-D]
IC?#5  CG2214M6-C2  [SOTFL48P130X55-6N]
IC?#6  BGU7224X  [SON50P160X160X50-7N]
J?#3  J3P  [J3P]
J?#4  J3P  [J3P]
J?#5  USB TYPE C  [2171790001_MOL]
J?#6  EMPCB.SMAFSTJ.B.HT  [TAOGLAS_EMPCB.SMAFSTJ.B.HT]
J?#7  EMPCB.SMAFSTJ.B.HT  [TAOGLAS_EMPCB.SMAFSTJ.B.HT]
J?#8  J3P  [J3P]
J?#9  S4B-PH-SM4-TB_LF__SN_  [S4B-PH-SM4-TB]
J?#10  XT30PB  [XT30PB]
L?#2  ASPI-0630LR-150  [ASPI-0630LR-150]
L?#3  LQG15HS8N2G02D  [LQG15WH0N7B02D]
PS?  TLV75733PDRVR  [SON65P200X200X80-7N]
Q?#1  BC847AMTF  [SOT95P240X120-3N]  (value not drawn)
Q?#2  BC847AMTF  [SOT95P240X120-3N]  (value not drawn)
R?#3  10K  [RESC1005X37N]
R?#4  100K  [RESC1005X37N]
R?#5  210K  [RESC1005X37N]
R?#6  1K  [RESC1005X37N]
R?#7  10K  [RESC1005X37N]
R?#8  40.2K  [RESC1005X37N]
R?#9  24.9K  [RESC1005X37N]
R?#10  100K  [RESC1005X37N]
R?#11  10K  [RESC1005X37N]
R?#12  24.9K  [RESC1005X37N]
R?#13  100K  [RESC1005X37N]
R?#14  10K  [RESC1005X37N]
R?#15  40.2K  [RESC1005X37N]
R?#16  1K  [RESC1005X37N]
R?#17  1K  [RESC1005X37N]
R?#18  10K  [RESC1005X37N]
R?#19  10K  [RESC1005X37N]
R?#20  10K  [RESC1005X37N]
R?#21  10K  [RESC1005X37N]
R?#22  10K  [RESC1005X37N]
S?#1  SKTAAAE010  [SKTAAAE010]
S?#2  1101M2S5AQE2  [1101M2S5AQE2]
SW?  Component_1  [5 WAY SWITCH]
U?#1  MP1584EN  [SOIC127P600X170-9N]
U?#2  ESP-01F  [MODULE_ESP-01F]
U?#3  CH340G  [SOIC127P600X175-16N]
XTAL?  NX2016SA-52MHZ-EXS00A-CS07103  [OSCCC200X160X50N]
Y?  12MHz  [XTAL_SXT2248EE17-12.000MT]
Z?#1  5.1V, 500mW  [SOD3716X135N]
Z?#2  5.1V, 500mW  [SOD3716X135N]

### Nets
3.3V: C?#3.1 C?#4.2 C?#6.2 C?#15.1 C?#30.2 C?#36.2 C?#38.1 IC?#2.2(3V3) IC?#4.11(VBAT_IO) IC?#4.15(VBAT) IC?#6.6(VCC) PS?.1(OUT) R?#3.2 R?#11.2 R?#14.2 R?#21.2 U?#2.17(VDD) U?#3.16(VCC)
5V TO BUCK: C?#8.1 R?#4.2 S?#2.2(COM) U?#1.7(VIN)
+5: C?#7.2 C?#9.1 C?#10.1 C?#18.1 C?#19.1 C?#20.1 C?#21.1 C?#31.2 IC?#3.5(VBIAS) IC?#3.14(VCC2) IC?#3.16(VCC1) L?#2.2 PS?.4(EN) PS?.6(IN) R?#5.2 R?#18.2 Z?#1.1(K) Z?#2.1(K)
GND: C?#3.2 C?#4.1 C?#6.1 C?#7.1 C?#8.2 C?#9.2 C?#10.2 C?#12.1 C?#13.2 C?#14.2 C?#15.2 C?#16.1 C?#17.2 C?#18.2 C?#19.2 C?#20.2 C?#21.2 C?#22.2 C?#23.1 C?#24.2 C?#26.1 C?#27.1 C?#28.1 C?#30.1 C?#31.1 C?#32.1 C?#33.2 C?#34.2 C?#35.2 C?#36.1 C?#38.2 D?#1.2(A) D?#4.2(A) D?#5.2(GND) D?#7.2(A) D?#8.2(A) F?#2.1 F?#3.1 FL?#2.4(GND) FL?#3.4(GND) FL?#4.4(GND) IC?#2.1(GND_1) IC?#2.38(GND_3) IC?#2.39(GND_4) IC?#3.1(GND) IC?#3.3(GND) IC?#3.4(GND) IC?#3.7(GND) IC?#3.8(GND) IC?#3.10(GND) IC?#3.11(GND) IC?#3.13(GND) IC?#3.15(GND) IC?#3.17(EP) IC?#4.5(GND_1) IC?#4.13(GND_2) IC?#4.20(GND_3) IC?#4.21(GND_4) IC?#4.23(GND_5) IC?#4.24(GND_6) IC?#4.25(EP) IC?#5.2(GND) IC?#6.3(GND_1) IC?#6.4(GND_2) IC?#6.7(GND_3) J?#5.A1/B12(GND_2) J?#5.B1/A12(GND) J?#6.SH1 J?#6.SH2 J?#6.SH3 J?#6.SH4 J?#7.SH1 J?#7.SH2 J?#7.SH3 J?#7.SH4 J?#9.3 J?#10.2 L?#3.1 PS?.3(GND_1) PS?.7(GND_2) R?#6.1 R?#7.1 R?#8.1 R?#9.1 R?#10.1 R?#12.1 R?#13.1 R?#15.1 R?#22.1 S?#1.2 S?#1.4 SW?.6(D) U?#1.5(GND) U?#1.9(GND) U?#2.2(GND) U?#2.18(GND) U?#2.19(EP) U?#3.1(GND) XTAL?.2(GND) XTAL?.4(GND) Z?#1.2(A) Z?#2.2(A)
6.5V: D?#8.1(K) J?#9.4 S?#2.3(NO)
BUSY: IC?#2.33(IO21) IC?#4.7(BUSY)
DIO1: IC?#2.26(IO4) IC?#4.8(DIO1)
DIO2: IC?#2.24(IO2) IC?#4.9(DIO2)
DIO3: IC?#4.10(DIO3)
DN: D?#5.6(I/O4) J?#5.A7(DN1) J?#5.B7(DN2) U?#3.6(UD-)
DP: D?#5.1(I/O1) J?#5.A6(DP1) J?#5.B6(DP2) U?#3.5(UD+)
DTR: C?#13.1 IC?#2.3(EN) Q?#1.3(C) Q?#2.2(E) R?#11.1 R?#19.1 U?#3.13(~{DTR})  [also labelled EN]
FB: R?#5.1 R?#15.2 U?#1.4(FB)
IO0: C?#14.1 IC?#2.25(IO0) Q?#2.3(C) R?#14.1
JOY STICK: C?#12.2 IC?#2.10(IO25) R?#3.1 SW?.1(C)
LIPO: J?#10.1 S?#2.1(NC)
MISO: IC?#2.31(IO19) IC?#4.16(MISO_TX)
MOSI: IC?#2.37(IO23) IC?#4.17(MOSI_RX)
NC: J?#9.1
NRST: IC?#2.13(IO14) IC?#4.3(NRESET)
NSS: IC?#2.29(IO5) IC?#4.19(NSS_CTS)
PAEN: C?#35.1 IC?#3.6(PAEN) R?#18.1
RTS: Q?#1.2(E) R?#20.1 U?#3.14(~{RTS})
RX: C?#28.2 IC?#2.12(IO27) IC?#5.6(VC1)
RX0: D?#2.1 IC?#2.34(RXD0) J?#3.1
RX 8266: D?#3.2 J?#3.3 U?#2.14(RX)
RX CTRL: IC?#6.1(CTRL) J?#8.2
RXD0: J?#3.2 R?#17.1
S.PORT: D?#7.1(K) IC?#2.16(IO13) J?#9.2
SCK: IC?#2.30(IO18) IC?#4.18(SCK_RTSN)
SCLK: IC?#2.8(IO32)
SDA: IC?#2.36(IO22)
TX: C?#34.1 IC?#2.11(IO26) IC?#5.4(VC2)
TX0: D?#3.1 IC?#2.35(TXD0) J?#4.3
TX 8266: D?#2.2 J?#4.1 U?#2.15(TX)
TXD0: J?#4.2 R?#16.1
VBUS: D?#5.5(VCC) FB?.1 J?#5.A4/B9(VBUS_2) J?#5.B4/A9(VBUS)
VDD_IN: C?#27.2 C?#32.2 IC?#4.2(VDD_IN) IC?#4.12(DCC_FB)
NetC?#5_1: C?#5.1 U?#1.8(BST)
NetC?#5_2: C?#5.2 D?#1.1(K) L?#2.1 U?#1.1(SW)
NetC?#11_1: C?#11.1 R?#10.2
NetC?#11_2: C?#11.2 U?#1.3(COMP)
NetC?#16_2: C?#16.2 U?#3.7(XI) Y?.3
NetC?#17_1: C?#17.1 U?#3.8(XO) Y?.1
NetC?#22_1: C?#22.1 C?#23.2 C?#24.1 IC?#3.12(VCC3)
NetC?#25_1: C?#25.1 FL?#2.1(IN)
NetC?#25_2: C?#25.2 IC?#5.1(RF1)
NetC?#26_2: C?#26.2 IC?#4.1(VR_PA)
NetC?#29_1: C?#29.1 IC?#5.5(RFC)
NetC?#29_2: C?#29.2 FL?#3.3(OUT)
NetC?#33_1: C?#33.1 D?#6.2(A) FB?.2
NetC?#37_1: C?#37.1 FL?#4.1(IN)
NetC?#37_2: C?#37.2 IC?#5.3(RF2)
NetD?#4_1: D?#4.1(K) S?#1.1 S?#1.3 U?#2.11(IO0)
NetF?#2_2: F?#2.2 IC?#3.9(RFOUT) J?#6.1
NetF?#3_2: F?#3.2 IC?#6.2(RF_IN) J?#7.1 L?#3.2
NetFL?#2_3: FL?#2.3(OUT) IC?#3.2(RFIN)
NetFL?#3_1: FL?#3.1(IN) IC?#4.22(RFIO)
NetFL?#4_3: FL?#4.3(OUT) IC?#6.5(RF_OUT)
NetIC?#4_4: IC?#4.4(XTA) XTAL?.3(B)
NetIC?#4_6: IC?#4.6(XTB) XTAL?.1(A)
NetJ?#8_1: J?#8.1 R?#21.1
NetJ?#8_3: J?#8.3 R?#22.2
NetQ?#1_1: Q?#1.1(B) R?#19.2
NetQ?#2_1: Q?#2.1(B) R?#20.2
NetR?#4_1: R?#4.1 R?#12.2 U?#1.2(EN)
NetR?#6_2: R?#6.2 SW?.2(L)
NetR?#7_2: R?#7.2 SW?.3(C)
NetR?#8_2: R?#8.2 SW?.5(R)
NetR?#9_2: R?#9.2 SW?.4(U)
NetR?#13_2: R?#13.2 U?#1.6(FREQ)
NetR?#16_2: R?#16.2 U?#3.3(RXD)
NetR?#17_2: R?#17.2 U?#3.2(TXD)

Not connected (* = marked no-connect by the designer): D?#5 3(I/O2) 4(I/O3); D?#6 1(K); FL?#2 2(GND); FL?#3 2(GND); FL?#4 2(GND); IC?#2 4(SENSOR_VP) 5(SENSOR_VN) 6(IO34) 7(IO35) 9(IO33) 14(IO12) 15(GND_2) 17(SHD/SD2) 18(SWP/SD3) 19(SCS/CMD) 20(SCK/CLK) 21(SDO/SD0) 22(SDI/SD1) 23(IO15) 27(IO16) 28(IO17) 32(NC); IC?#4 14(DCC_SW)*; J?#5 A5(CC1) A8(SBU1) B5(CC2) B8(SBU2); PS? 2(NC_1) 5(NC_2); U?#2 1(ANT) 3(ADC) 4(EN) 5(IO16) 6(IO14) 7(IO12) 8(IO13) 9(IO15) 10(IO2) 12(IO4) 13(IO5) 16(~{RST}); U?#3 4(V3)* 9(~{CTS})* 10(~{DSR})* 11(~{RI})* 12(~{DCD})* 15(RS232)*

### Layout directives
net class RF: NetC?#25_1, NetC?#25_2, NetC?#29_1, NetC?#29_2, NetC?#37_1, NetC?#37_2, NetF?#2_2, NetF?#3_2, NetFL?#2_3, NetFL?#3_1, NetFL?#4_3

### Notes on the sheet
- Labels drawn without touching a wire or pin: +5

### Library data of the parts
C?#3 C?#8-C?#10 C?#13 C?#19 C?#21 C?#24 = CL21B104KBCNNNC: as C1 on sheet OD JRBAY; Availability: Unavailable; Package: None; MP: CL21B104KBCNNNC; Value: *; Price: None
C?#4 C?#5 C?#11 C?#12 C?#14 C?#18 C?#20 C?#22 C?#25 C?#28-C?#30 C?#32 C?#34-C?#38 = 04025C104KAT2A: as C2 on sheet OD JRBAY; Availability: Unavailable; Package: None; MP: 04025C104KAT2A; Value: *; Price: None
C?#6 C?#7 C?#23 C?#26 C?#27 C?#31 = CL10F104ZB8NNNC: as C3 on sheet OD JRBAY; Availability: Unavailable; Package: None; MP: CL10F104ZB8NNNC; Value: *; Price: None
C?#15 = CL10B104KB8NNNL: as C32 on sheet OD JRBAY; MFR Part no: CL10B104KB8NNNL; Package: 0603 [1608 Metric]
C?#16 C?#17 = CL10B105KP8NNNC: as C33 on sheet OD JRBAY; Component Name: 22PF ,16V; Package: 0603 (1608 Metric)
C?#33 = C0603: Component Name: *; MFR Part no: *; Manufacturer: *; Unit Price/(500pcs): *; Package: *
D?#1 = B340A-13-F: Diode; Manufacturer_Name: Diodes Inc.; Datasheet Link: https://datasheet.datasheetarchive.com/originals/distributors/Datasheets-305/73551.pdf; Height: 2.4mm; Manufacturer_Part_Number: B340A-13-F; Mouser Part Number: 621-B340A-F; Mouser Price/Stock: https://www.mouser.co.uk/ProductDetail/Diodes-Incorporated/B340A-13-F?qs=aLaTXeBcTP9fj%2FYKVo6Q1A%3D%3D; Arrow Part Number: B340A-13-F; Arrow Price/Stock: https://www.arrow.com/en/products/b340a-13-f/diodes-incorporated?region=nac
D?#4 D?#7 D?#8 = ESD5Z3.3T1G: as D6 on sheet OD JRBAY; Datasheet Link: http://www.onsemi.com/pub/Collateral/ESD5Z2.5T1-D.PDF; Height: 0.7mm; Manufacturer_Part_Number: ESD5Z3.3T1G; Mouser Part Number: 863-ESD5Z3.3T1G; Mouser Price/Stock: https://www.mouser.co.uk/ProductDetail/onsemi/ESD5Z33T1G?qs=OSf9jACorvaH3Y8oRWEcuQ%3D%3D; Arrow Part Number: ESD5Z3.3T1G; Arrow Price/Stock: https://www.arrow.com/en/products/esd5z3.3t1g/on-semiconductor?region=nac; MFR Part no: ESD5Z3.3T1G; Package: SOD-523-2
D?#5 = SP0504SHTG: as D2 on sheet OD JRBAY; Datasheet Link: http://www.littelfuse.com/~/media/electronics/datasheets/tvs_diode_arrays/littelfuse_tvs_diode_array_sp0504s_datasheet.pdf.pdf; Height: 1.45mm; Manufacturer_Part_Number: SP0504SHTG; Mouser Part Number: 576-SP0504SHTG; Mouser Price/Stock: https://www.mouser.co.uk/ProductDetail/Littelfuse/SP0504SHTG?qs=VPR2Pdj9HgCFO7boWWEmwA%3D%3D; Arrow Part Number: SP0504SHTG; Arrow Price/Stock: https://www.arrow.com/en/products/sp0504shtg/littelfuse?region=nac; MFR Part no: SP0504SHTG; Package: SOT23
D?#6 = B340A-13-F: as D5 on sheet OD JRBAY; Package: DO-214AC; MFR Part no: SUNROM 4447
F?#2 F?#3 = PGB1010603NR: as F1 on sheet OD JRBAY; Datasheet Link: https://componentsearchengine.com/Datasheets/2/PGB1010603NR.pdf; Height: 0.36mm; Manufacturer_Part_Number: PGB1010603NR; Mouser Part Number: 576-PGB1010603NR; Mouser Price/Stock: https://www.mouser.co.uk/ProductDetail/Littelfuse/PGB1010603NR?qs=gu7KAQ731UTJOoBJUwB8FA%3D%3D; Arrow Part Number: PGB1010603NR; Arrow Price/Stock: https://www.arrow.com/en/products/pgb1010603nr/littelfuse?region=nac; MFR Part no: PGB1010603NR; Package: 0603 [1608 Metric]
FB? = MPZ2012S221A: as FB1 on sheet OD JRBAY; Component Name: 600 OHM; Package: 0805 (2012 Metric)
FL?#2-FL?#4 = 2450FM07D0034T: as FL1 on sheet OD JRBAY; Value: *; Availability: Unavailable; Price: None; Package: None; MP: 2450FM07D0034T
IC?#2 = ESP-WROOM-32D: as IC1 on sheet OD JRBAY; Datasheet Link: https://componentsearchengine.com/Datasheets/1/ESP-WROOM-32D.pdf; Height: 3.2mm; Manufacturer_Part_Number: ESP-WROOM-32D; Mouser Part Number: 356-ESP-WROOM-32D; Mouser Price/Stock: https://www.mouser.co.uk/ProductDetail/Espressif-Systems/ESP-WROOM-32D?qs=MLItCLRbWsyWVKgdQMcFuQ%3D%3D
IC?#4 = SX1280IMLTRT: as IC2 on sheet OD JRBAY; Datasheet Link: https://datasheet.datasheetarchive.com/originals/distributors/DKDS-37/728740.pdf; Height: 1mm; Manufacturer_Part_Number: SX1280IMLTRT; Mouser Part Number: 947-SX1280IMLTRT; Mouser Price/Stock: https://www.mouser.co.uk/ProductDetail/Semtech/SX1280IMLTRT?qs=5aG0NVq1C4xuoq8G6ZzdxQ%3D%3D; Arrow Part Number: SX1280IMLTRT; Arrow Price/Stock: https://www.arrow.com/en/products/sx1280imltrt/semtech
IC?#5 = CG2214M6-C2: as IC3 on sheet OD JRBAY; Datasheet Link: http://www.cel.com/pdf/datasheets/CG2214M6.pdf; Height: 0.55mm; Manufacturer_Part_Number: CG2214M6-C2; Mouser Part Number: 551-CG2214M6-C2; Mouser Price/Stock: https://www.mouser.co.uk/ProductDetail/CEL/CG2214M6-C2?qs=tucQmhgEO3pgt47Dr78trg%3D%3D; Arrow Part Number: CG2214M6-C2; Arrow Price/Stock: https://www.arrow.com/en/products/cg2214m6-c2/california-eastern-laboratories
IC?#6 = BGU7224X: as IC?#1 on sheet OD JRBAY; Datasheet Link: http://www.nxp.com/docs/en/data-sheet/BGU7224.pdf; Height: 0.5mm; Manufacturer_Part_Number: BGU7224X; Mouser Part Number: 771-BGU7224X; Mouser Price/Stock: https://www.mouser.co.uk/ProductDetail/NXP-Semiconductors/BGU7224X?qs=Sd2AGZv2AHkyYARpdSjAzA%3D%3D; Arrow Part Number: BGU7224X; Arrow Price/Stock: https://www.arrow.com/en/products/bgu7224x/nxp-semiconductors
J?#5 = 2171790001: as J6 on sheet OD JRBAY; SymbolName_1: 2171790001; LibraryName: TYPE C; DeviceSetName: 2171790001; COPYRIGHT: Copyright (C) 2021 Ultra Librarian. All rights reserved.; DIGI-KEY_PART_NUMBER_1: 900-2171790001TR-ND; DIGI-KEY_PART_NUMBER_2: 900-2171790001CT-ND; DIGI-KEY_PART_NUMBER_3: 900-2171790001DKR-ND; MANUFACTURER_PART_NUMBER: 2171790001; Component Name: USB TYPE C; Package: THROUGH HOLE
J?#6 J?#7 = EMPCB.SMAFSTJ.B.HT: as J5 on sheet OD JRBAY; Value: *; Package: None; Digi-Key_Part_Number: 931-1175-ND; Digi-Key_Purchase_URL: https://www.digikey.com/product-detail/en/taoglas-limited/EMPCB.SMAFSTJ.B.HT/931-1175-ND/3522337?utm_source=snapeda&utm_medium=aggregator&utm_campaign=symbol; MP: EMPCB.SMAFSTJ.B.HT; SnapEDA_Link: https://www.snapeda.com/parts/EMPCB.SMAFSTJ.B.HT/Taoglas%20Limited/view-part/231078/?ref=snap
J?#9 = S4B-PH-SM4-TB_LF__SN_: as J1 on sheet OD JRBAY; Datasheet Link: http://uk.rs-online.com/web/p/products/6881366; Arrow Part Number: S4B-PH-SM4-TB(LF)(SN); Arrow Price/Stock: https://www.arrow.com/en/products/s4b-ph-sm4-tb-lf-sn/jst-manufacturing
J?#10 = XT30PB: Connector; Manufacturer_Name: Amass; Datasheet Link: https://www.tme.eu/Document/4acc913878197f8c2e30d4b8cdc47230/XT30UPB%20SPEC.pdf; Height: 10.7mm; Manufacturer_Part_Number: XT30PB
L?#3 = LQG15HS8N2G02D: as L?#1 on sheet OD JRBAY; Datasheet Link: https://psearch.en.murata.com/inductor/product/LQG15HS8N2G02%23.html; Height: 0.55mm; Manufacturer_Part_Number: LQG15HS8N2G02D; Mouser Part Number: 81-LQG15HS8N2G02D; Mouser Price/Stock: https://www.mouser.co.uk/ProductDetail/Murata-Electronics/LQG15HS8N2G02D?qs=d0WKAl%252BL4KapDveqKJ4FDA%3D%3D
PS? = TLV75733PDRVR: as PS1 on sheet OD JRBAY; Datasheet Link: http://www.ti.com/lit/gpn/tlv757p; Height: 0.8mm; Manufacturer_Part_Number: TLV75733PDRVR; Mouser Part Number: 595-TLV75733PDRVR; Mouser Price/Stock: https://www.mouser.co.uk/ProductDetail/Texas-Instruments/TLV75733PDRVR?qs=W0yvOO0ixfGlytsi33vetg%3D%3D; Arrow Part Number: TLV75733PDRVR; Arrow Price/Stock: https://www.arrow.com/en/products/tlv75733pdrvr/texas-instruments?region=nac
Q?#1 Q?#2 = BC847AMTF: as Q1 on sheet OD JRBAY; Datasheet Link: http://www.onsemi.com/pub/Collateral/BC846-D.PDF; Height: 1.2mm; Manufacturer_Part_Number: BC847AMTF; Mouser Part Number: 512-BC847AMTF; Mouser Price/Stock: https://www.mouser.com/Search/Refine.aspx?Keyword=512-BC847AMTF; Arrow Part Number: BC847AMTF; Arrow Price/Stock: https://www.arrow.com/en/products/bc847amtf/on-semiconductor; Component Name: TRANSISTOR; Package: SOT23
R?#3-R?#22 = RE0402BRE07330KL: MF: {'manufacturer': u'Yageo'}; Availability: Unavailable; Package: None; MP: RE0402BRE07330KL; Value: *; Price: None
S?#1 = SKTAAAE010: Switch; Manufacturer_Name: ALPS; Datasheet Link: https://componentsearchengine.com/Datasheets/1/SKTAAAE010.pdf; Height: 0.63mm; Manufacturer_Part_Number: SKTAAAE010; Mouser Part Number: 688-SKTAAAE010; Mouser Price/Stock: https://www.mouser.co.uk/ProductDetail/ALPS/SKTAAAE010?qs=u4fy%2FsgLU9NVRRqWeykmWg%3D%3D
S?#2 = 1101M2S5AQE2: as S2 on sheet OD JRBAY; Datasheet Link: https://www.arrow.com/en/products/1101m2s5aqe2/ck; Height: 6.6mm; Manufacturer_Part_Number: 1101M2S5AQE2; Mouser Part Number: 611-1101M2S5AQE2; Mouser Price/Stock: https://www.mouser.co.uk/ProductDetail/CK/1101M2S5AQE2?qs=lwH5WijZ8egIsHAjqlMdZA%3D%3D; Arrow Part Number: 1101M2S5AQE2; Arrow Price/Stock: https://www.arrow.com/en/products/1101m2s5aqe2/ck?region=nac; MFR Part no: SUNROM 5263; Package: THROUGH HOLE
U?#1 = MP1584EN: as U2 on sheet OD JRBAY; Availability: Unavailable; Package: None; MP: MP1584EN; Value: *; Price: None
U?#2 = ESP-01F: as U1 on sheet OD JRBAY; SnapEDA_Link: https://www.snapeda.com/parts/ESP-01F/AI-Thinker/view-part/5470732/?ref=snap; Availability: Unavailable; Price: None; Package: Package; Check_prices: https://www.snapeda.com/parts/ESP-01F/AI-Thinker/view-part/5470732/?ref=eda; Value: *; MP: ESP-01F
XTAL? = NX2016SA-52MHZ-EXS00A-CS07103: as XTAL1 on sheet OD JRBAY; Value: *; Availability: Unavailable; Price: None; Package: None; MP: NX2016SA-52MHZ-EXS00A-CS07103
Y? = SXT2248EE17-12.000MT: MF: {'manufacturer': u'Suntsu'}; Package: None; Value: *; Availability: Unavailable; MP: SXT2248EE17-12.000MT; Price: None
Z?#1 Z?#2 = MMSZ5231BT1G: as Z1 on sheet OD JRBAY; Datasheet Link: http://www.onsemi.com/pub_link/Collateral/MMSZ5221BT1-D.PDF; Height: 1.35mm; Manufacturer_Part_Number: MMSZ5231BT1G; Mouser Part Number: 863-MMSZ5231BT1G; Mouser Price/Stock: https://www.mouser.co.uk/ProductDetail/onsemi/MMSZ5231BT1G?qs=P4IOph%252Bbot%2FUEpHENPMrdw%3D%3D; Arrow Part Number: MMSZ5231BT1G; Arrow Price/Stock: https://www.arrow.com/en/products/mmsz5231bt1g/on-semiconductor?region=nac; MFR Part no: MMSZ5231BT1G; Package: SOD123
U?#3 = CH340G: Package: None

## Nets that join several sheets
3.3V: OD JRBAY (18 pins), Reference sche (18 pins)
5V TO BUCK: OD JRBAY (C28.1 R5.2 S2.2 U2.7), Reference sche (C?#8.1 R?#4.2 S?#2.2 U?#1.7)
+5: OD JRBAY (18 pins), Reference sche (18 pins)
GND: OD JRBAY (102 pins), Reference sche (102 pins)
6.5V: OD JRBAY (D8.1 J1.4 S2.3), Reference sche (D?#8.1 J?#9.4 S?#2.3)
BUSY: OD JRBAY (IC1.33 IC2.7), Reference sche (IC?#2.33 IC?#4.7)
DIO1: OD JRBAY (IC1.26 IC2.8), Reference sche (IC?#2.26 IC?#4.8)
DIO2: OD JRBAY (IC1.24 IC2.9), Reference sche (IC?#2.24 IC?#4.9)
DIO3: OD JRBAY (IC2.10), Reference sche (IC?#4.10)
DN: OD JRBAY (D2.6 J6.A7 J6.B7 U3.6), Reference sche (D?#5.6 J?#5.A7 J?#5.B7 U?#3.6)
DP: OD JRBAY (D2.1 J6.A6 J6.B6 U3.5), Reference sche (D?#5.1 J?#5.A6 J?#5.B6 U?#3.5)
DTR: OD JRBAY (7 pins), Reference sche (7 pins)
FB: OD JRBAY (R6.1 R10.2 U2.4), Reference sche (R?#5.1 R?#15.2 U?#1.4)
IO0: OD JRBAY (C20.1 IC1.25 Q2.3 R4.1), Reference sche (C?#14.1 IC?#2.25 Q?#2.3 R?#14.1)
JOY STICK: OD JRBAY (C36.2 IC1.10 R15.1 SW1.1), Reference sche (C?#12.2 IC?#2.10 R?#3.1 SW?.1)
LIPO: OD JRBAY (J7.1 S2.1), Reference sche (J?#10.1 S?#2.1)
MISO: OD JRBAY (IC1.31 IC2.16), Reference sche (IC?#2.31 IC?#4.16)
MOSI: OD JRBAY (IC1.37 IC2.17), Reference sche (IC?#2.37 IC?#4.17)
NC: OD JRBAY (J1.1), Reference sche (J?#9.1)
NRST: OD JRBAY (IC1.13 IC2.3), Reference sche (IC?#2.13 IC?#4.3)
NSS: OD JRBAY (IC1.29 IC2.19), Reference sche (IC?#2.29 IC?#4.19)
PAEN: OD JRBAY (C17.1 IC5.6 R20.1), Reference sche (C?#35.1 IC?#3.6 R?#18.1)
RTS: OD JRBAY (Q1.2 R3.1 U3.14), Reference sche (Q?#1.2 R?#20.1 U?#3.14)
RX: OD JRBAY (C14.2 IC1.12 IC3.6), Reference sche (C?#28.2 IC?#2.12 IC?#5.6)
RX0: OD JRBAY (D3.1 IC1.34 J3.1), Reference sche (D?#2.1 IC?#2.34 J?#3.1)
RX 8266: OD JRBAY (D4.2 J3.3 U1.14), Reference sche (D?#3.2 J?#3.3 U?#2.14)
RX CTRL: OD JRBAY (IC?#1.1 J?#2.2), Reference sche (IC?#6.1 J?#8.2)
RXD0: OD JRBAY (J3.2 R14.1), Reference sche (J?#3.2 R?#17.1)
S.PORT: OD JRBAY (D7.1 IC1.16 J1.2), Reference sche (D?#7.1 IC?#2.16 J?#9.2)
SCK: OD JRBAY (IC1.30 IC2.18), Reference sche (IC?#2.30 IC?#4.18)
SCLK: OD JRBAY (IC1.8), Reference sche (IC?#2.8)
SDA: OD JRBAY (IC1.36), Reference sche (IC?#2.36)
TX: OD JRBAY (C18.1 IC1.11 IC3.4), Reference sche (C?#34.1 IC?#2.11 IC?#5.4)
TX0: OD JRBAY (D4.1 IC1.35 J4.3), Reference sche (D?#3.1 IC?#2.35 J?#4.3)
TX 8266: OD JRBAY (D3.2 J4.1 U1.15), Reference sche (D?#2.2 J?#4.1 U?#2.15)
TXD0: OD JRBAY (J4.2 R13.1), Reference sche (J?#4.2 R?#16.1)
VBUS: OD JRBAY (D2.5 FB1.1 J6.A4/B9 J6.B4/A9), Reference sche (D?#5.5 FB?.1 J?#5.A4/B9 J?#5.B4/A9)
VDD_IN: OD JRBAY (C22.2 C24.2 IC2.2 IC2.12), Reference sche (C?#27.2 C?#32.2 IC?#4.2 IC?#4.12)